# Altium schematic sheet BigDriver.SchDoc: Драйвер двигателей
size 594 x 420 mm; ApprovedBy: Алексеев; CheckedBy: Алексеев; CompanyName: ЦНИИ РТК; DrawnBy: Подлесный; DocumentNumber: СКТБ.436267.001 Э3; SheetTotal: 1; Format: A2; DocumentType: Схема электрическая принципиальная; ImagePath: Введите номер платы
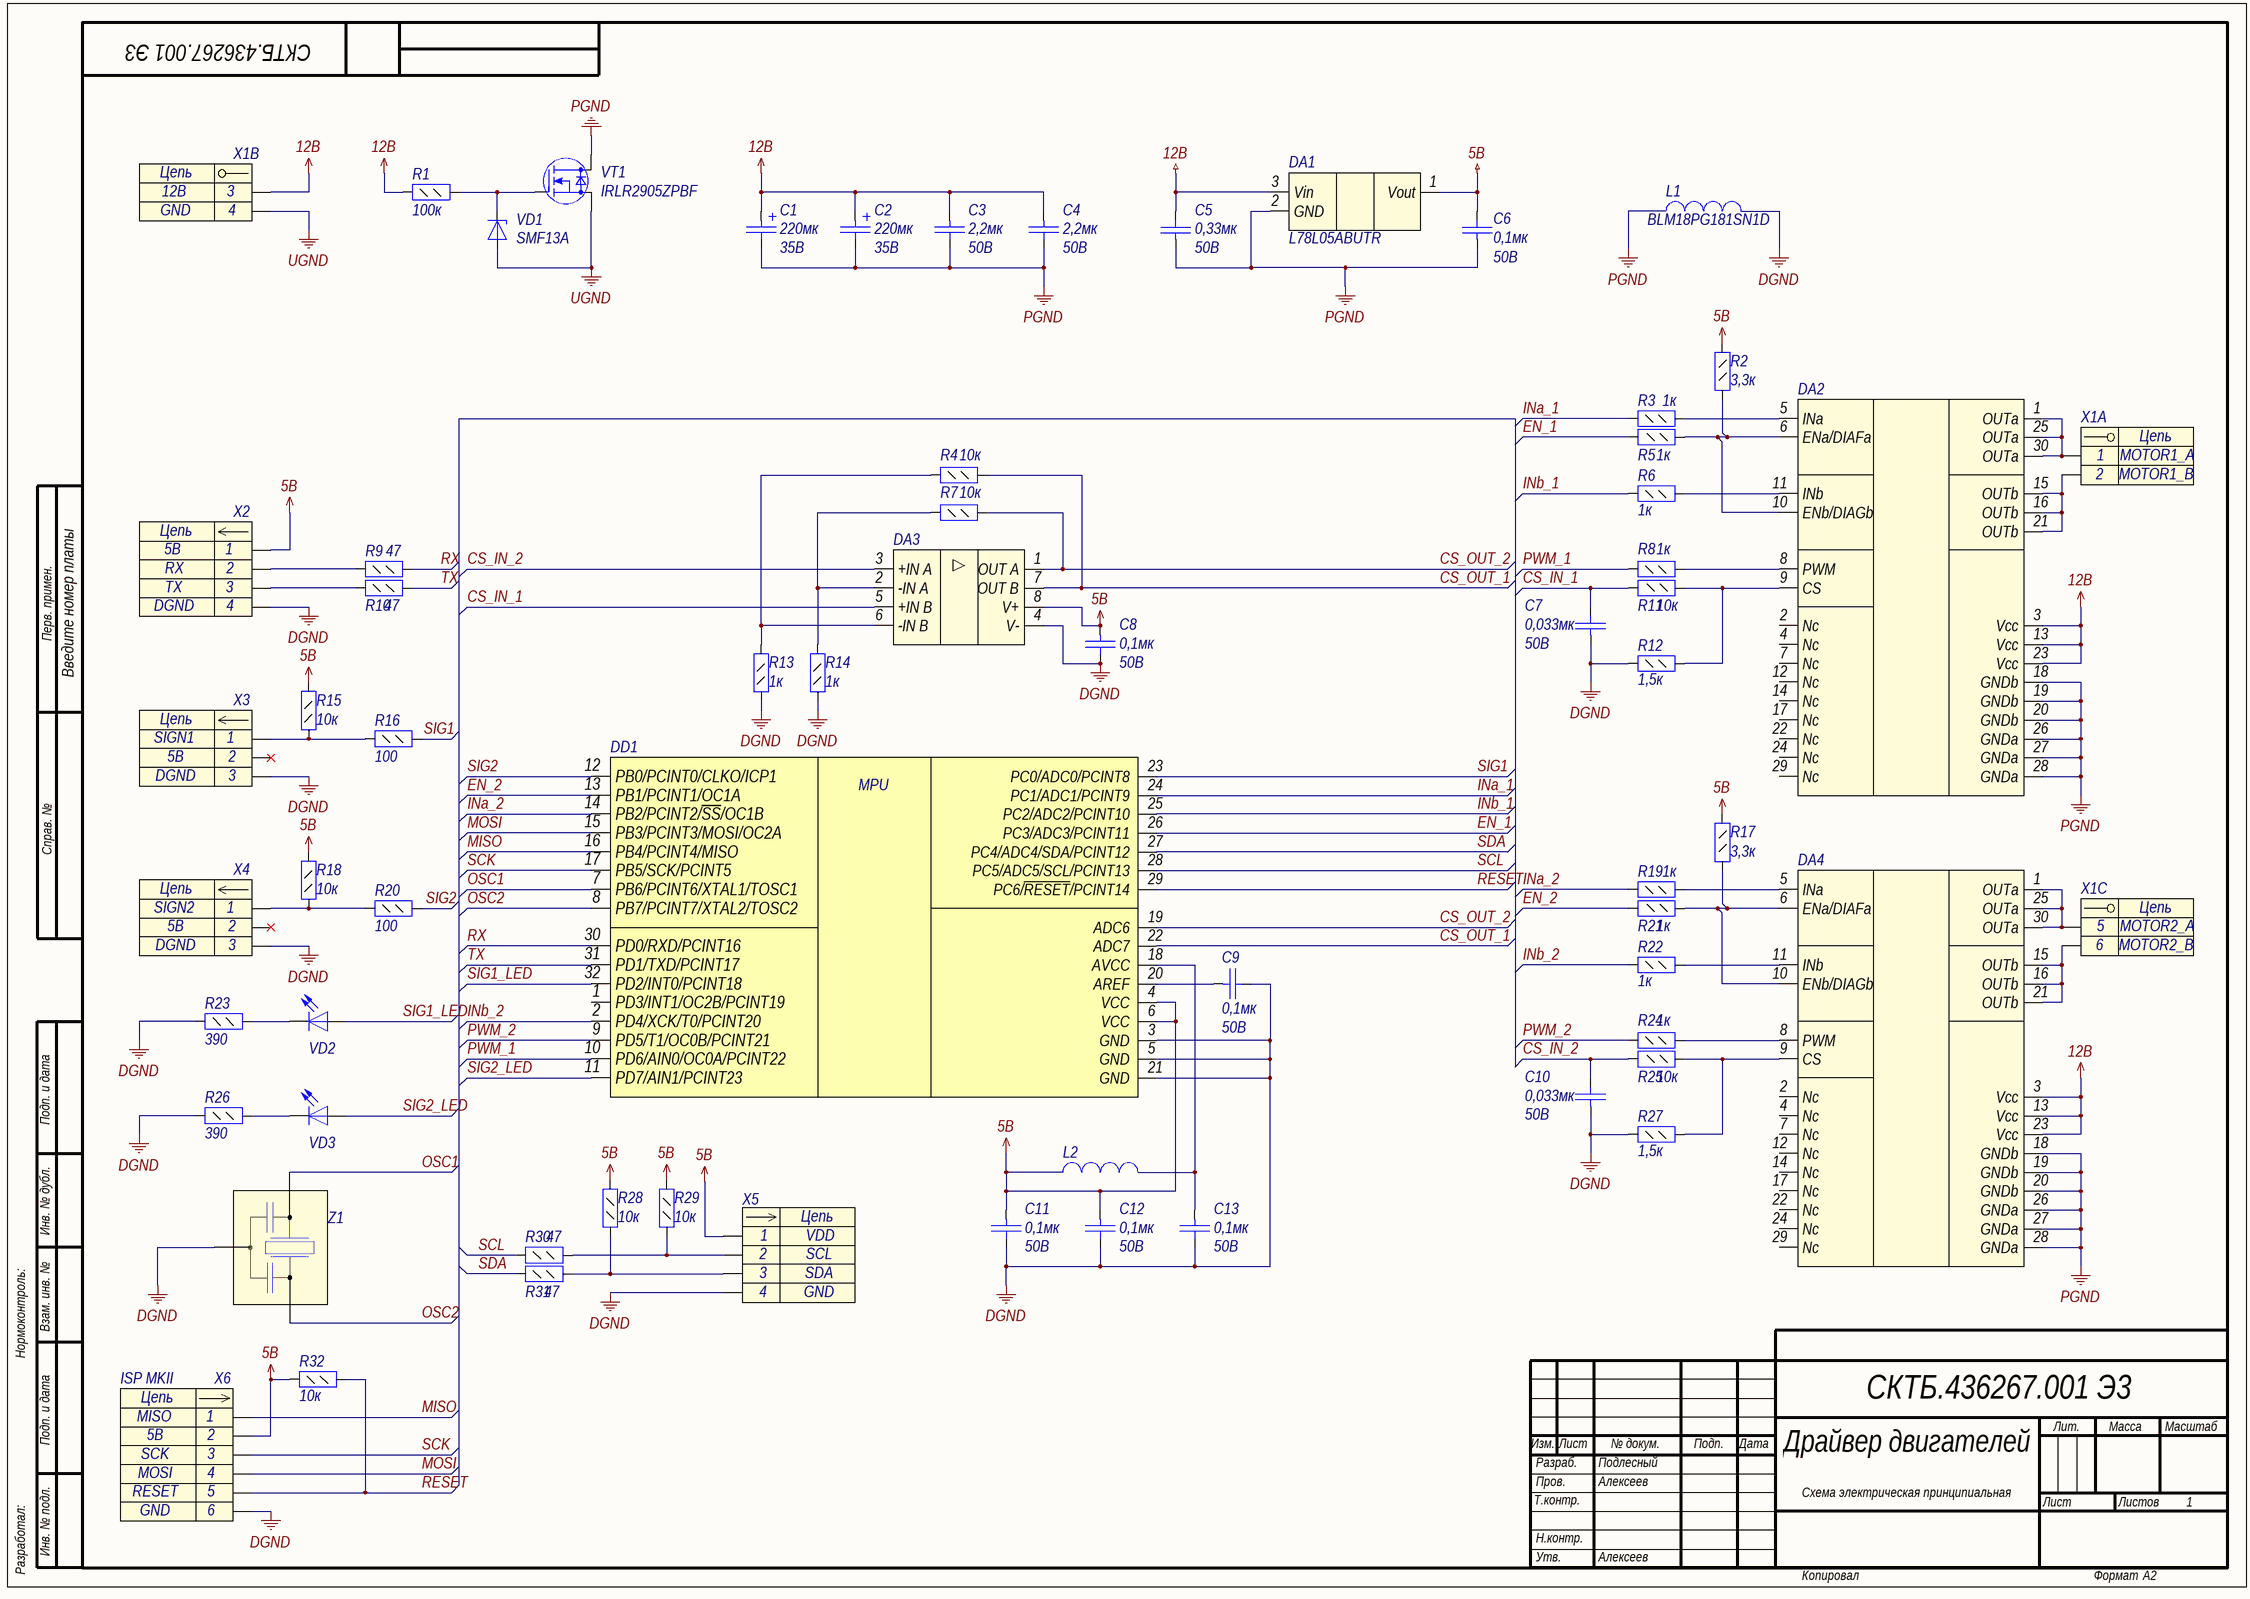
[diagram p0: BigDriver.SchDoc]

## Parts
C1  value 220мк  Voltage: 35В  [k50-35(8x11.5)_MIRROR]  (hidden comment: Capacitor_pol)
C2  value 220мк  Voltage: 35В  [k50-35(8x11.5)_MIRROR]  (hidden comment: Capacitor_pol)
C3  value 2,2мк  Voltage: 50В  [C1206]  (hidden comment: Capacitor)
C4  value 2,2мк  Voltage: 50В  [C1206]  (hidden comment: Capacitor)
C5  value 0,33мк  Voltage: 50В  [C1206]  (hidden comment: Capacitor)
C6  value 0,1мк  Voltage: 50В  [C0805]  (hidden comment: Capacitor)
C7  value 0,033мк  Voltage: 50В  [C1206]  (hidden comment: Capacitor)
C8  value 0,1мк  Voltage: 50В  [C0805]  (hidden comment: Capacitor)
C9  value 0,1мк  Voltage: 50В  [C0805]  (hidden comment: Capacitor)
C10  value 0,033мк  Voltage: 50В  [C1206]  (hidden comment: Capacitor)
C11  value 0,1мк  Voltage: 50В  [C0805]  (hidden comment: Capacitor)
C12  value 0,1мк  Voltage: 50В  [C0805]  (hidden comment: Capacitor)
C13  value 0,1мк  Voltage: 50В  [C0805]  (hidden comment: Capacitor)
DA1  L78L05ABUTR  [SOT-89-3]
DA2  VNH2SP30-E  [MultiPowerSO-30]  (value not drawn)
DA3  LMV358IDR  [SO8]  (value not drawn)
DA4  VNH2SP30-E  [MultiPowerSO-30]  (value not drawn)
DD1  ATmega328P-AU  [TQFP-32]  (value not drawn)
L1  Part Number: BLM18PG181SN1D  [L0603]  (hidden comment: Inductor)
L2  Inductor  [L0603]  (value not drawn)
R1  value 100к  [R0805]  (hidden comment: Resistor_0,125Вт)
R2  value 3,3к  [R0805]  (hidden comment: Resistor_0,125Вт)
R3  value 1к  [R0805]  (hidden comment: Resistor_0,125Вт)
R4  value 10к  [R0805]  (hidden comment: Resistor_0,125Вт)
R5  value 1к  [R0805]  (hidden comment: Resistor_0,125Вт)
R6  value 1к  [R0805]  (hidden comment: Resistor_0,125Вт)
R7  value 10к  [R0805]  (hidden comment: Resistor_0,125Вт)
R8  value 1к  [R0805]  (hidden comment: Resistor_0,125Вт)
R9  value 47  [R0805]  (hidden comment: Resistor_0,125Вт)
R10  value 47  [R0805]  (hidden comment: Resistor_0,125Вт)
R11  value 10к  [R0805]  (hidden comment: Resistor_0,125Вт)
R12  value 1,5к  [R0805]  (hidden comment: Resistor_0,125Вт)
R13  value 1к  [R0805]  (hidden comment: Resistor_0,125Вт)
R14  value 1к  [R0805]  (hidden comment: Resistor_0,125Вт)
R15  value 10к  [R0805]  (hidden comment: Resistor_0,125Вт)
R16  value 100  [R0805]  (hidden comment: Resistor_0,125Вт)
R17  value 3,3к  [R0805]  (hidden comment: Resistor_0,125Вт)
R18  value 10к  [R0805]  (hidden comment: Resistor_0,125Вт)
R19  value 1к  [R0805]  (hidden comment: Resistor_0,125Вт)
R20  value 100  [R0805]  (hidden comment: Resistor_0,125Вт)
R21  value 1к  [R0805]  (hidden comment: Resistor_0,125Вт)
R22  value 1к  [R0805]  (hidden comment: Resistor_0,125Вт)
R23  value 390  [R0805]  (hidden comment: Resistor_0,125Вт)
R24  value 1к  [R0805]  (hidden comment: Resistor_0,125Вт)
R25  value 10к  [R0805]  (hidden comment: Resistor_0,125Вт)
R26  value 390  [R0805]  (hidden comment: Resistor_0,125Вт)
R27  value 1,5к  [R0805]  (hidden comment: Resistor_0,125Вт)
R28  value 10к  [R0805]  (hidden comment: Resistor_0,125Вт)
R29  value 10к  [R0805]  (hidden comment: Resistor_0,125Вт)
R30  value 47  [R0805]  (hidden comment: Resistor_0,125Вт)
R31  value 47  [R0805]  (hidden comment: Resistor_0,125Вт)
R32  value 10к  [R0805]  (hidden comment: Resistor_0,125Вт)
VD1  Part Number: SMF13A  [SOD-123]  (hidden comment: DiodeZener)
VD2  LED  [L_0805]  (value not drawn)
VD3  LED  [L_0805]  (value not drawn)
VT1  Part Number: IRLR2905ZPBF  [DPAK]  (hidden comment: N-MOSFET)
X1  (no value)  [TERMINAL-6WAY-5MM]  (parts A,B,C of 3)
X2  Header_4_plg  [PLS-4]  (value not drawn)
X3  Header_3_plg  [PLS-3]  (value not drawn)
X4  Header_3_plg  [PLS-3]  (value not drawn)
X5  Header_4_plg  [PLS-4]  (value not drawn)
X6  ISP MKII  [PLS2-6]
Z1  QuartzWithCaps  [CSTCE]  (value not drawn)

## Nets
5B: C6.2 C8.1 C11.1 C12.1 DA1.1(Vout) DA3.8(V+) DD1.4(VCC) DD1.6(VCC) L2.1 R2.1 R15.2 R17.1 R18.2 R28.2 R29.2 R32.1 X2.1 X5.1 X6.2
12B: C1.1 C2.1 C3.1 C4.1 C5.2 DA1.3(Vin) DA2.3(Vcc) DA2.13(Vcc) DA2.23(Vcc) DA4.3(Vcc) DA4.13(Vcc) DA4.23(Vcc) R1.1 X1.3
DGND: C7.1 C8.2 C9.2 C10.1 C11.2 C12.2 C13.2 DA3.4(V-) DD1.3(GND) DD1.5(GND) DD1.21(GND) L1.2 R12.1 R13.1 R14.1 R23.1 R26.1 R27.1 X2.4 X3.3 X4.3 X5.4 X6.6 Z1.2
PGND: C1.2 C2.2 C3.2 C4.2 C5.1 C6.1 DA1.2(GND) DA2.18(GNDb) DA2.19(GNDb) DA2.20(GNDb) DA2.26(GNDa) DA2.27(GNDa) DA2.28(GNDa) DA4.18(GNDb) DA4.19(GNDb) DA4.20(GNDb) DA4.26(GNDa) DA4.27(GNDa) DA4.28(GNDa) L1.1 VT1.2(D)
UGND: VD1.2(A) VT1.3(S) X1.4
CS_IN_1: C7.2 DA3.5(+IN_B) R11.2
CS_IN_2: C10.2 DA3.3(+IN_A) R25.2
CS_OUT_1: DA3.7(OUT_B) DD1.22(ADC7) R4.2
CS_OUT_2: DA3.1(OUT_A) DD1.19(ADC6) R7.2
EN_1: DD1.26(PC3/ADC3/PCINT11) R5.2
EN_2: DD1.13(PB1/PCINT1/OC1A) R21.2
INa_1: DD1.24(PC1/ADC1/PCINT9) R3.1
INa_2: DD1.14(PB2/PCINT2/~{SS}/OC1B) R19.1
INb_1: DD1.25(PC2/ADC2/PCINT10) R6.1
INb_2: DD1.2(PD4/XCK/T0/PCINT20) R22.1
MISO: DD1.16(PB4/PCINT4/MISO) X6.1
MOSI: DD1.15(PB3/PCINT3/MOSI/OC2A) X6.4
OSC1: DD1.7(PB6/PCINT6/XTAL1/TOSC1) Z1.3
OSC2: DD1.8(PB7/PCINT7/XTAL2/TOSC2) Z1.1
PWM_1: DD1.10(PD6/AIN0/OC0A/PCINT22) R8.1
PWM_2: DD1.9(PD5/T1/OC0B/PCINT21) R24.1
RESET: DD1.29(PC6/~{RESET}/PCINT14) R32.2 X6.5
RX: DD1.30(PD0/RXD/PCINT16) R9.2
SCK: DD1.17(PB5/SCK/PCINT5) X6.3
SCL: DD1.28(PC5/ADC5/SCL/PCINT13) R30.1
SDA: DD1.27(PC4/ADC4/SDA/PCINT12) R31.1
SIG1: DD1.23(PC0/ADC0/PCINT8) R16.2
SIG1_LED: DD1.32(PD2/INT0/PCINT18) VD2.2(A)
SIG2: DD1.12(PB0/PCINT0/CLKO/ICP1) R20.2
SIG2_LED: DD1.11(PD7/AIN1/PCINT23) VD3.2(A)
TX: DD1.31(PD1/TXD/PCINT17) R10.2
NetC9_1: C9.1 DD1.20(AREF)
NetC13_1: C13.1 DD1.18(AVCC) L2.2
NetDA2_1: DA2.1(OUTa) DA2.25(OUTa) DA2.30(OUTa) X1.1
NetDA2_5: DA2.5(INa) R3.2
NetDA2_6: DA2.6(ENa/DIAFa) DA2.10(ENb/DIAGb) R2.2 R5.1
NetDA2_8: DA2.8(PWM) R8.2
NetDA2_9: DA2.9(CS) R11.1 R12.2
NetDA2_11: DA2.11(INb) R6.2
NetDA2_15: DA2.15(OUTb) DA2.16(OUTb) DA2.21(OUTb) X1.2
NetDA3_2: DA3.2(-IN_A) R7.1 R14.2
NetDA3_6: DA3.6(-IN_B) R4.1 R13.2
NetDA4_1: DA4.1(OUTa) DA4.25(OUTa) DA4.30(OUTa) X1.5
NetDA4_5: DA4.5(INa) R19.2
NetDA4_6: DA4.6(ENa/DIAFa) DA4.10(ENb/DIAGb) R17.2 R21.1
NetDA4_8: DA4.8(PWM) R24.2
NetDA4_9: DA4.9(CS) R25.1 R27.2
NetDA4_11: DA4.11(INb) R22.2
NetDA4_15: DA4.15(OUTb) DA4.16(OUTb) DA4.21(OUTb) X1.6
NetR1_2: R1.2 VD1.1(K) VT1.1(G)
NetR9_1: R9.1 X2.2
NetR10_1: R10.1 X2.3
NetR15_1: R15.1 R16.1 X3.1
NetR18_1: R18.1 R20.1 X4.1
NetR23_2: R23.2 VD2.1(K)
NetR26_2: R26.2 VD3.1(K)
NetR28_1: R28.1 R31.2 X5.3
NetR29_1: R29.1 R30.2 X5.2

Not connected (* = marked no-connect by the designer): DA2 2(Nc) 4(Nc) 7(Nc) 12(Nc) 14(Nc) 17(Nc) 22(Nc) 24(Nc) 29(Nc); DA4 2(Nc) 4(Nc) 7(Nc) 12(Nc) 14(Nc) 17(Nc) 22(Nc) 24(Nc) 29(Nc); DD1 1(PD3/INT1/OC2B/PCINT19); X3 2*; X4 2*

## Notes on the sheet
- Перв. примен.
- Справ. №
- Подп. и дата
- Инв. № дубл.
- Нормоконтроль:
- Взам. инв. №
- Изм.
- Лист
- № докум.
- Подп.
- Дата
- Лит.
- Масса
- Масштаб
- Т.контр.
- Пров.
- Разраб.
- Листов
- Разработал:
- Инв. № подл.
- Н.контр.
- Утв.
- Копировал
- Формат
- (in symbol connect11, part A) Цепь
- (in symbol connect11, part B) Цепь
- (in symbol connect11, part C) Цепь
- (in symbol connect14) Цепь
- (in symbol connect33) Цепь
- (in symbol connect40) Цепь
- (in symbol microcont1) MPU

## Library data of the parts
C1 C2 = cap221: Конденсатор полярный; Part Name: Electrolit; Manufacture: Jamicon; Part Number: TKR221M1VF11; id: cap221; tga: 0,20%
C3 C4 = cap205: Конденсатор; Part Name: Ceramic; Manufacture: Murata; Part Number: GRM31CR71H225KA88**L; id: cap205; TKE: X7R
C5 = cap183: Конденсатор; Part Name: Capacitors; Part Number: GRM319R71H334K; id: cap183; TKE: X7R
C6 = cap161: Конденсатор; Part Name: Capacitors; Part Number: GRM21BR71H104KA01L; id: cap161; TKE: X7R
C7 C10 = cap207: Конденсатор; Part Name: Ceramic; Manufacture: Murata; Part Number: GRM3195C1H333J; id: cap207; TKE: NP0
C8 C9 C11-C13 = cap162: Конденсатор; Part Name: Ceramic; Manufacture: Murata; Part Number: GRM216R71H221K; id: cap162; TKE: X7R
DA1 = pwr6: Cтабилизатор напряжения (+5В; 0.1А), 4%, (-40...+125C); Part Name: Positive voltage regulators; Manufacturer: ST Microelectronics; id: pwr6; Input Voltage: 40B; Output Voltage: 5B; Current: 0,1A; Type: Linear; Part Number: L78L05ABUTR
DA2 DA4 = driver9: Automotive fully integrated H-bridge motor driver; Manufacture: ST Microelectronics; Operating Supply Voltage: 5,5-16B; Min Operating Supply Voltage: 5,5B; Max Operating Supply Voltage: 41B; Max Supply Current: 60uA; PWM frequency: 20kHz; Maximum output current: 30A; id: driver9; Part Name: Automotive fully integrated H-bridge motor driver; Part Number: VNH2SP30-E
DA3 = amp2: LOW-VOLTAGE RAIL-TO-RAIL OUTPUT OPERATIONAL AMPLIFIERS; Manufacture: Texas Instruments; id: amp2; Rail-to-rail: yes; Supply Voltage: 2,7-5B; Supply Current max: 210 max 440 typ uA; Bandwidth: 1MHz; Input Bias Current: 15-250nA; CMRR: 63dB; PSRR: 60dB; Offset voltage: 1,7mB; Channels: 2; Part Name: OPERATIONAL AMPLIFIERS; Part Number: LMV358IDR
DD1 = microcont1: Микроконтроллер 8-Бит, picoPower, AVR, 20МГц, 32КБ Flash; Part Name: Microcontroller; Frequency: 20MHz; ADC: 8x10b; Interface: i2c, spi, uart; Flash: 32kb; Pin in: 23; Power Supply: 1.8-5.5 V; id: microcont1; Part Number: ATmega328P-AU
L1 = ind0: EMI Suppression Filter; Part Name: EMI Suppression Filters; Rated Current: 1,5A; id: ind0; Resistance: 0,09Ohm
L2 = ind0: EMI Suppression Filter; Part Name: EMI Suppression Filters; Part Number: BLM18PG181SN1D; Rated Current: 1,5A; id: ind0; Resistance: 0,09Ohm
R1 = res121: Резистор; Manufacture: Yageo; Part Number: RC0805FR-07100KL; id: res121; Accuracy: 1%; Part Name: Resistor; Power: 0,125Вт
R2 R3 R5 R6 R8 R11 R12 R15 R17-R19 R21 R22 R24 R25 R27-R29 R32 = res97: Резистор; Manufacture: Yageo; Part Number: RC0805FR-0710KL; id: res97; Accuracy: 1%; Part Name: Resistor; Power: 0,125Вт
R4 R7 = res97: Резистор; Manufacture: Yageo; Part Number: RC0805FR-0710KL; id: res97; Accuracy: 0,01; Part Name: Resistor; Power: 0,125Вт
R9 R10 R30 R31 = res41: Резистор; Manufacture: Yageo; Part Number: RC0805FR-0747RL; id: res41; Accuracy: 1%; Part Name: Resistor; Power: 0,125Вт
R13 R14 = res73: Резистор; Manufacture: Yageo; Part Number: RC0805FR-071KL; id: res73; Accuracy: 0,01; Part Name: Resistor; Power: 0,125Вт
R16 R20 = res49: Резистор; Manufacture: Yageo; Part Number: RC0805FR-07100RL; id: res49; Accuracy: 1%; Part Name: Resistor; Power: 0,125Вт
R23 R26 = res63: Резистор; Manufacture: Yageo; Part Number: RC0805FR-07390RL; id: res63; Accuracy: 0,01; Part Name: Resistor; Power: 0,125Вт
VD1 = SMF13A: Cтабилитрон (лавинный выпрямительный диод) односторонний; Part Name: TVS diode Unidirectional; Manufacture: Yangjie Technology; id: tvs166; Leakage Current: 1uA; Stand-off Voltage: 13B; Breakdown Voltage: 14,4B; Clamping voltage: 21,5B; Peak Pulse Power: 200W; Number of diodes: 1
VD2 VD3 = diode5: Светодиод; Part Number: KP-2012EC; id: diode5; Part Name: LED
VT1 = trans9: Manufacturer: International Rectifier; id: trans9; Structure: n-channel; V drain-source max: 55B; Rds: 0,0135Ohm; Gate-to-source voltage: (+-)16B; Continuous drain current: 60A; Pulsed drain current: 240A; Power dissipation: 110W
X1 = connect11: POWER; Part Name: TERMINAL BLOCK 6 way; Contact_2: MOTOR1_B; Contact_1: MOTOR1_A; Etch: 5mm; Contact_5: Contact_5; Contact_6: Contact_6; Contact_4: Contact_4; Contact_3: Contact_3; id: connect11
X2 = connect14: Разъем - 4 конт. вилка; Part Number: DS1021-1*4SF112-B; Manufacture: Ningbo connfly electronic; Contact_1: 5B; Contact_2: RX; Contact_3: TX; Contact_4: DGND; Etch: 2,54mm; Part Name: PLS-4; id: connect14
X3 = connect33: Разъем - 3 конт. вилка; Part Number: DS1021-1*3SF112-B; Manufacture: Ningbo connfly electronic; Contact_1: SIGN1; Contact_2: 5B; Contact_3: DGND; Etch: 2,54mm; Part Name: PLS-3; id: connect33
X4 = connect33: Разъем - 3 конт. вилка; Part Number: DS1021-1*3SF112-B; Manufacture: Ningbo connfly electronic; Contact_1: SIGN2; Contact_2: 5B; Contact_3: DGND; Etch: 2,54mm; Part Name: PLS-3; id: connect33
X5 = connect14: Разъем - 4 конт. вилка; Part Number: DS1021-1*4SF112-B; Manufacture: Ningbo connfly electronic; Contact_1: VDD; Contact_2: SCL; Contact_3: SDA; Contact_4: GND; Etch: 2,54mm; Part Name: PLS-4; id: connect14
X6 = connect40: Разъем - 6 конт. вилка; Contact_1: MISO; Contact_2: 5B; Contact_3: SCK; Contact_4: MOSI; Contact_5: RESET; Contact_6: GND; Part Name: MKII; id: connect40
Z1 = crystal5: Кварцевый резорнатор со встроенными нагрузочными конденсаторами; Manufacture: Murata; Part Number: CSTCE12M0G52-R0; Frequence: 12MHz; id: crystal5